# EAGLE schematic pcm2705_DAC (EAGLE 6.2)
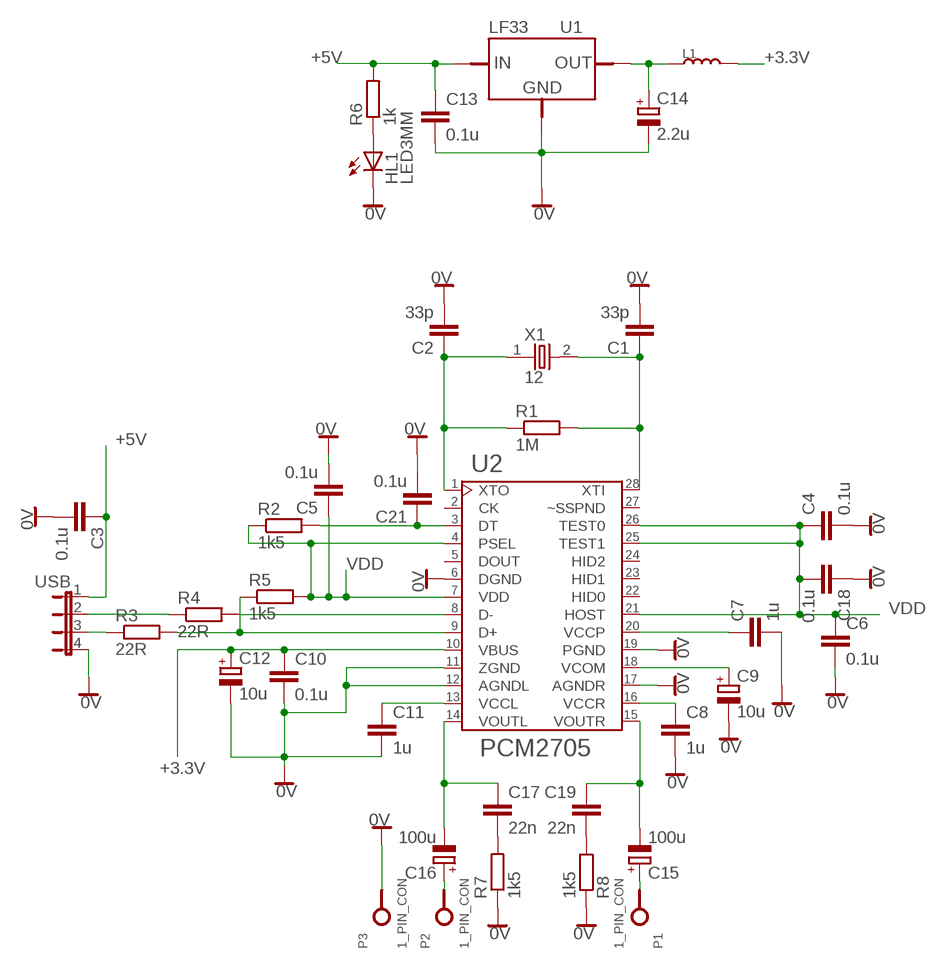
[diagram p0: schematic, sheet 1]

## Parts
C1  33p  C0805  [C0805D]
C2  33p  C0805  [C0805D]
C3  0.1u  C0805  [C0805D]
C4  0.1u  C0805  [C0805D]
C5  0.1u  C0805  [C0805D]
C6  0.1u  C0805  [C0805D]
C7  1u  C0805  [C0805D]
C8  1u  C0805  [C0805D]
C9  10u  C100MFX25V  [C100MILX6X12]
C10  0.1u  C0805  [C0805D]
C11  1u  C0805  [C0805D]
C12  10u  C100MFX25V  [C100MILX6X12]
C13  0.1u  C0805  [C0805D]
C14  2.2u  C100MFX25V  [C100MILX6X12]
C15  100u  C100MFX25V  [C100MILX6X12]
C16  100u  C100MFX25V  [C100MILX6X12]
C17  22n  C0805  [C0805D]
C18  0.1u  C0805  [C0805D]
C19  22n  C0805  [C0805D]
C21  0.1u  C0805  [C0805D]
HL1  LED3MM  [LED3MM]
L1  INDUCTOR  [INDUCTOR]
P1  1_PIN_CON  [1_PIN_CON]
P2  1_PIN_CON  [1_PIN_CON]
P3  1_PIN_CON  [1_PIN_CON]
R1  1M  R0805  [R0805D]
R2  1k5  R0805  [R0805D]
R3  22R  R0805  [R0805D]
R4  22R  R0805  [R0805D]
R5  1k5  R0805  [R0805D]
R6  1k  R0805  [R0805D]
R7  1k5  R0805  [R0805D]
R8  1k5  R0805  [R0805D]
U1  LF33  [LF33_DPAK]
U2  PCM2705  [PCM2705-TSSOP28]
USB  JP4E  [JP4]
X1  12  HC49/S  [HC49/S]

## Nets
0V: C1.2 C2.2 C3.2 C4.2 C5.2 C6.2 C7.2 C8.2 C9.MINUS(-) C10.2 C11.2 C12.MINUS(-) C13.2 C14.MINUS(-) C18.1 C21.2 HL1.K(C) P3.P$1 R7.P$1 R8.P$1 U1.@GND1(GND) U2.6(DGND) U2.11(ZGND) U2.12(AGNDL) U2.17(AGNDR) U2.19(PGND) USB.4
+3.3V: C10.1 C12.PLUS(+) L1.P$2 U2.10(VBUS)
+5V: C3.1 C13.1 R6.P$2 U1.@IN1(IN) USB.1
N$1: C2.1 R1.P$1 U2.1(XTO) X1.1
N$2: C7.1 U2.20(VCCP)
N$3: C1.1 R1.P$2 U2.28(XTI) X1.2
N$4: C21.1 R2.P$2 U2.3(DT)
N$5: R3.P$2 R5.P$1 U2.9(D+)
N$6: R4.P$2 U2.8(D-)
N$7: R3.P$1 USB.3
N$8: R4.P$1 USB.2
N$9: HL1.A R6.P$1
N$10: C8.1 U2.16(VCCR)
N$11: C9.PLUS(+) U2.18(VCOM)
N$12: C15.PLUS(+) P1.P$1
N$13: C11.1 U2.13(VCCL)
N$14: C16.PLUS(+) P2.P$1
N$15: U2.4(PSEL)
N$16: C14.PLUS(+) L1.P$1 U1.@OUT1(OUT)
N$17: C16.MINUS(-) C17.1 U2.14(VOUTL)
N$18: C17.2 R7.P$2
N$19: C15.MINUS(-) C19.1 U2.15(VOUTR)
N$20: C19.2 R8.P$2
VDD: C4.1 C5.1 C6.1 C18.2 R2.P$1 R5.P$2 U2.7(VDD) U2.21(HOST) U2.25(TEST1) U2.26(TEST0)
Unconnected: U2.2(CK) U2.5(DOUT) U2.22(HID0) U2.23(HID1) U2.24(HID2) U2.27(~SSPND)

## Library data of the parts
C1-C8 C10 C11 C13 C17-C19 C21 = den:C0805
C9 C12 C14-C16 = den:C100MFX25V
HL1 = den:LED3MM
L1 = Dmitry:INDUCTOR
P1-P3 = Dmitry:1_PIN_CON
R1-R8 = den:R0805
U1 = Dmitry:LF33
U2 = Dmitry:PCM2705
USB = jumper:JP4E: JUMPER
X1 = den:HC49/S